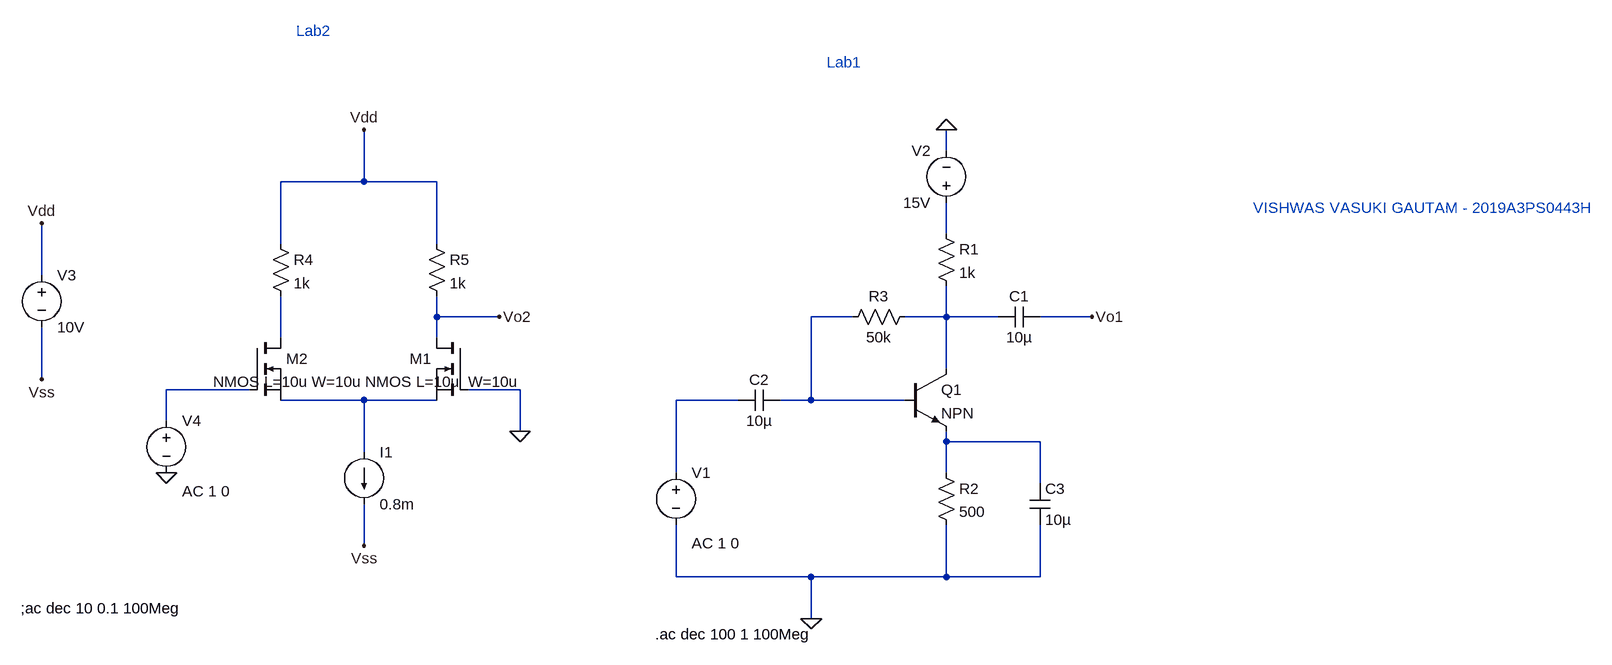
[diagram p0: schematic lab10_1and2.asc]
lab10_1and2.asc, the LTspice schematic file:
Version 4
SHEET 1 1308 680
WIRE 240 -208 240 -240
WIRE -656 -160 -656 -240
WIRE -656 -160 -784 -160
WIRE -544 -160 -656 -160
WIRE 240 -80 240 -128
WIRE -784 -64 -784 -160
WIRE -544 -64 -544 -160
WIRE -1152 -16 -1152 -96
WIRE -544 48 -544 16
WIRE -448 48 -544 48
WIRE 96 48 32 48
WIRE 240 48 240 0
WIRE 240 48 176 48
WIRE 320 48 240 48
WIRE 464 48 384 48
WIRE -784 80 -784 16
WIRE -544 80 -544 48
WIRE 240 128 240 48
WIRE -1152 144 -1152 64
WIRE -832 160 -960 160
WIRE -416 160 -496 160
WIRE -656 176 -784 176
WIRE -544 176 -656 176
WIRE -80 176 -176 176
WIRE 32 176 32 48
WIRE 32 176 -16 176
WIRE 176 176 32 176
WIRE -960 208 -960 160
WIRE -416 224 -416 160
WIRE 240 240 240 224
WIRE 384 240 240 240
WIRE -656 256 -656 176
WIRE -176 288 -176 176
WIRE 240 288 240 240
WIRE 384 304 384 240
WIRE -656 400 -656 336
WIRE -176 448 -176 368
WIRE 32 448 -176 448
WIRE 240 448 240 368
WIRE 240 448 32 448
WIRE 384 448 384 368
WIRE 384 448 240 448
WIRE 32 512 32 448
FLAG 240 -240 0
FLAG 32 512 0
FLAG -656 400 Vss
FLAG -656 -240 Vdd
FLAG -416 224 0
FLAG -1152 -96 Vdd
FLAG -1152 144 Vss
FLAG -960 288 0
FLAG 464 48 Vo1
FLAG -448 48 Vo2
SYMBOL res 224 -96 R0
SYMATTR InstName R1
SYMATTR Value 1k
SYMBOL res 224 272 R0
SYMATTR InstName R2
SYMATTR Value 500
SYMBOL res 192 32 R90
WINDOW 0 0 56 VBottom 2
WINDOW 3 32 56 VTop 2
SYMATTR InstName R3
SYMATTR Value 50k
SYMBOL npn 176 128 R0
SYMATTR InstName Q1
SYMBOL cap 384 32 R90
WINDOW 0 0 32 VBottom 2
WINDOW 3 32 32 VTop 2
SYMATTR InstName C1
SYMATTR Value 10µ
SYMBOL cap -16 160 R90
WINDOW 0 0 32 VBottom 2
WINDOW 3 32 32 VTop 2
SYMATTR InstName C2
SYMATTR Value 10µ
SYMBOL voltage -176 272 R0
WINDOW 123 24 124 Left 2
WINDOW 39 0 0 Left 2
SYMATTR Value2 AC 1 0
SYMATTR InstName V1
SYMATTR Value ""
SYMBOL voltage 240 -112 R180
WINDOW 0 24 96 Left 2
WINDOW 3 24 16 Left 2
WINDOW 123 0 0 Left 2
WINDOW 39 0 0 Left 2
SYMATTR InstName V2
SYMATTR Value 15V
SYMBOL cap 368 304 R0
SYMATTR InstName C3
SYMATTR Value 10µ
SYMBOL nmos -496 80 M0
WINDOW 3 -80 68 Left 2
SYMATTR Value NMOS L=10u  W=10u
SYMATTR InstName M1
SYMBOL nmos -832 80 R0
WINDOW 3 -56 68 Left 2
SYMATTR Value NMOS L=10u W=10u
SYMATTR InstName M2
SYMBOL res -800 -80 R0
SYMATTR InstName R4
SYMATTR Value 1k
SYMBOL res -560 -80 R0
SYMATTR InstName R5
SYMATTR Value 1k
SYMBOL current -656 256 R0
WINDOW 123 0 0 Left 2
WINDOW 39 0 0 Left 2
SYMATTR InstName I1
SYMATTR Value 0.8m
SYMBOL voltage -1152 -32 R0
WINDOW 123 0 0 Left 2
WINDOW 39 0 0 Left 2
SYMATTR InstName V3
SYMATTR Value 10V
SYMBOL voltage -960 192 R0
WINDOW 123 24 124 Left 2
WINDOW 39 0 0 Left 2
SYMATTR Value2 AC 1 0
SYMATTR InstName V4
SYMATTR Value ""
TEXT 712 -120 Left 2 ;VISHWAS VASUKI GAUTAM - 2019A3PS0443H
TEXT -208 536 Left 2 !.ac dec 100 1 100Meg
TEXT -1184 496 Left 2 !;ac dec 10 0.1 100Meg
TEXT 56 -344 Left 2 ;Lab1
TEXT -760 -392 Left 2 ;Lab2

The netlist it stands for:
* lab10_1and2.asc
R1 N001 N003 1k
R2 N008 0 500
R3 N003 N002 50k
Q1 N003 N002 N008 0 NPN
C1 Vo1 N003 10µ
C2 N002 N007 10µ
V1 N007 0 AC 1 0
V2 N001 0 15V
C3 N008 0 10µ
M1 Vo2 0 N006 N006 NMOS L=10u  W=10u
M2 N004 N005 N006 N006 NMOS L=10u W=10u
R4 Vdd N004 1k
R5 Vdd Vo2 1k
I1 N006 Vss 0.8m
V3 Vdd Vss 10V
V4 N005 0 AC 1 0
.model NPN NPN
.model PNP PNP
.lib standard.bjt
.model NMOS NMOS
.model PMOS PMOS
.lib standard.mos
* VISHWAS VASUKI GAUTAM - 2019A3PS0443H
.ac dec 100 1 100Meg
;ac dec 10 0.1 100Meg
* Lab1
* Lab2
.backanno
.end